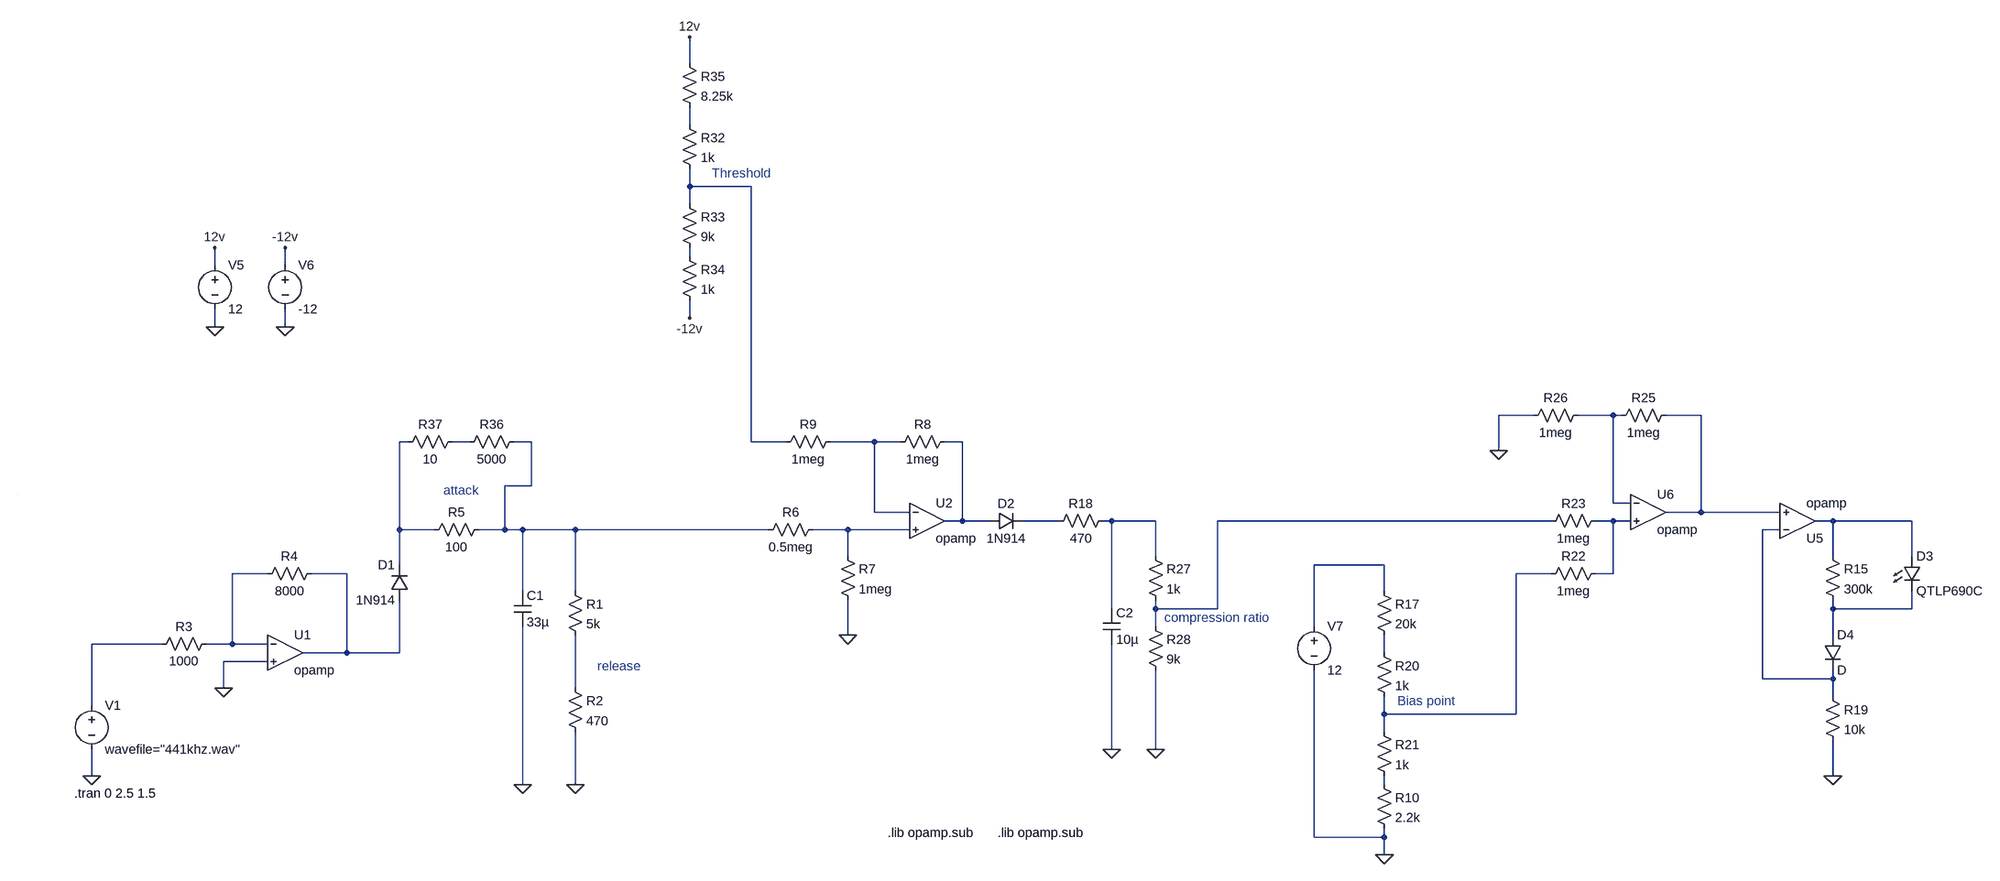
[diagram p0: schematic test_wavsource_2.asc]
test_wavsource_2.asc, the LTspice schematic file:
Version 4
SHEET 1 4852 868
WIRE 1808 -832 1808 -880
WIRE 1808 -720 1808 -752
WIRE 1808 -608 1808 -640
WIRE 1920 -608 1808 -608
WIRE 1808 -576 1808 -608
WIRE 1808 -480 1808 -496
WIRE 944 -464 944 -496
WIRE 1072 -464 1072 -496
WIRE 1808 -368 1808 -400
WIRE 944 -352 944 -384
WIRE 1072 -352 1072 -384
WIRE 3344 -144 3280 -144
WIRE 3488 -144 3424 -144
WIRE 3504 -144 3488 -144
WIRE 3648 -144 3584 -144
WIRE 1296 -96 1280 -96
WIRE 1408 -96 1376 -96
WIRE 1520 -96 1488 -96
WIRE 1920 -96 1920 -608
WIRE 1984 -96 1920 -96
WIRE 2144 -96 2064 -96
WIRE 2192 -96 2144 -96
WIRE 2304 -96 2272 -96
WIRE 3280 -80 3280 -144
WIRE 1520 -16 1520 -96
WIRE 1520 -16 1472 -16
WIRE 3488 16 3488 -144
WIRE 3520 16 3488 16
WIRE 2144 32 2144 -96
WIRE 2208 32 2144 32
WIRE 3648 32 3648 -144
WIRE 3648 32 3584 32
WIRE 3872 32 3648 32
WIRE 2304 48 2304 -96
WIRE 2304 48 2272 48
WIRE 2352 48 2304 48
WIRE 2480 48 2416 48
WIRE 2576 48 2560 48
WIRE 2656 48 2576 48
WIRE 3376 48 2768 48
WIRE 3488 48 3456 48
WIRE 3520 48 3488 48
WIRE 3968 48 3936 48
WIRE 4112 48 3968 48
WIRE 1280 64 1280 -96
WIRE 1344 64 1280 64
WIRE 1472 64 1472 -16
WIRE 1472 64 1424 64
WIRE 1504 64 1472 64
WIRE 1600 64 1504 64
WIRE 1952 64 1600 64
WIRE 2096 64 2032 64
WIRE 2208 64 2096 64
WIRE 3872 64 3840 64
WIRE 2096 112 2096 64
WIRE 2656 112 2656 48
WIRE 3968 112 3968 48
WIRE 4112 112 4112 48
WIRE 1280 128 1280 64
WIRE 3072 128 2944 128
WIRE 1040 144 976 144
WIRE 1184 144 1120 144
WIRE 3376 144 3312 144
WIRE 3488 144 3488 48
WIRE 3488 144 3456 144
WIRE 1504 176 1504 64
WIRE 1600 176 1600 64
WIRE 3072 176 3072 128
WIRE 2576 208 2576 48
WIRE 2656 208 2656 192
WIRE 2768 208 2768 48
WIRE 2768 208 2656 208
WIRE 3968 208 3968 192
WIRE 4112 208 4112 176
WIRE 4112 208 3968 208
WIRE 2656 240 2656 208
WIRE 2944 240 2944 128
WIRE 2096 256 2096 192
WIRE 3968 256 3968 208
WIRE 848 272 720 272
WIRE 976 272 976 144
WIRE 976 272 928 272
WIRE 1040 272 976 272
WIRE 1184 288 1184 144
WIRE 1184 288 1104 288
WIRE 1280 288 1280 192
WIRE 1280 288 1184 288
WIRE 3072 288 3072 256
WIRE 1040 304 960 304
WIRE 3840 336 3840 64
WIRE 3968 336 3968 320
WIRE 3968 336 3840 336
WIRE 960 352 960 304
WIRE 1600 352 1600 256
WIRE 3968 368 3968 336
WIRE 720 384 720 272
WIRE 3072 400 3072 368
WIRE 3312 400 3312 144
WIRE 3312 400 3072 400
WIRE 3072 432 3072 400
WIRE 2576 464 2576 272
WIRE 2656 464 2656 320
WIRE 720 512 720 464
WIRE 3968 512 3968 448
WIRE 1504 528 1504 240
WIRE 1600 528 1600 432
WIRE 3072 528 3072 512
WIRE 2944 624 2944 320
WIRE 3072 624 3072 608
WIRE 3072 624 2944 624
WIRE 3072 656 3072 624
WIRE 0 0 0 0
FLAG 720 512 0
FLAG 960 352 0
FLAG 1600 528 0
FLAG 1504 528 0
FLAG 3968 512 0
FLAG 3072 656 0
FLAG 3280 -80 0
FLAG 2656 464 0
FLAG 2576 464 0
FLAG 944 -352 0
FLAG 1072 -352 0
FLAG 1072 -496 -12v
FLAG 944 -496 12v
FLAG 1808 -880 12v
FLAG 1808 -368 -12v
FLAG 2096 256 0
SYMBOL voltage 720 368 R0
SYMATTR InstName V1
SYMATTR Value wavefile="441khz.wav"
SYMBOL diode 1296 192 R180
WINDOW 0 24 64 Left 2
WINDOW 3 24 0 Left 2
SYMATTR InstName D1
SYMATTR Value 1N914
SYMBOL cap 1488 176 R0
SYMATTR InstName C1
SYMATTR Value 33µ
SYMBOL res 1584 160 R0
SYMATTR InstName R1
SYMATTR Value 5k
SYMBOL Opamps\\opamp 1072 224 R0
SYMATTR InstName U1
SYMBOL res 1136 128 R90
WINDOW 0 0 56 VBottom 2
WINDOW 3 32 56 VTop 2
SYMATTR InstName R4
SYMATTR Value 8000
SYMBOL res 944 256 R90
WINDOW 0 0 56 VBottom 2
WINDOW 3 32 56 VTop 2
SYMATTR InstName R3
SYMATTR Value 1000
SYMBOL res 1584 336 R0
SYMATTR InstName R2
SYMATTR Value 470
SYMBOL res 1328 80 R270
WINDOW 0 32 56 VTop 2
WINDOW 3 0 56 VBottom 2
SYMATTR InstName R5
SYMATTR Value 100
SYMBOL Opamps\\opamp 2240 -16 R0
SYMATTR InstName U2
SYMBOL res 2176 -80 R270
WINDOW 0 32 56 VTop 2
WINDOW 3 0 56 VBottom 2
SYMATTR InstName R8
SYMATTR Value 1meg
SYMBOL res 1968 -80 R270
WINDOW 0 32 56 VTop 2
WINDOW 3 0 56 VBottom 2
SYMATTR InstName R9
SYMATTR Value 1meg
SYMBOL diode 2352 64 R270
WINDOW 0 32 32 VTop 2
WINDOW 3 0 32 VBottom 2
SYMATTR InstName D2
SYMATTR Value 1N914
SYMBOL Opamps\\opamp 3904 112 M180
SYMATTR InstName U5
SYMBOL LED 4096 112 R0
SYMATTR InstName D3
SYMATTR Value QTLP690C
SYMATTR Description Diode
SYMATTR Type diode
SYMBOL diode 3952 256 R0
SYMATTR InstName D4
SYMBOL res 3952 96 R0
SYMATTR InstName R15
SYMATTR Value 300k
SYMBOL res 3952 352 R0
SYMATTR InstName R19
SYMATTR Value 10k
SYMBOL Opamps\\opamp 3552 -32 R0
SYMATTR InstName U6
SYMBOL res 3056 272 R0
SYMATTR InstName R20
SYMATTR Value 1k
SYMBOL res 3056 416 R0
SYMATTR InstName R21
SYMATTR Value 1k
SYMBOL res 3472 128 R90
WINDOW 0 0 56 VBottom 2
WINDOW 3 32 56 VTop 2
SYMATTR InstName R22
SYMATTR Value 1meg
SYMBOL res 3472 32 R90
WINDOW 0 0 56 VBottom 2
WINDOW 3 32 56 VTop 2
SYMATTR InstName R23
SYMATTR Value 1meg
SYMBOL voltage 2944 224 R0
WINDOW 123 0 0 Left 2
WINDOW 39 0 0 Left 2
SYMATTR InstName V7
SYMATTR Value 12
SYMBOL res 3600 -160 R90
WINDOW 0 0 56 VBottom 2
WINDOW 3 32 56 VTop 2
SYMATTR InstName R25
SYMATTR Value 1meg
SYMBOL res 3440 -160 R90
WINDOW 0 0 56 VBottom 2
WINDOW 3 32 56 VTop 2
SYMATTR InstName R26
SYMATTR Value 1meg
SYMBOL res 2640 96 R0
SYMATTR InstName R27
SYMATTR Value 1k
SYMBOL res 2640 224 R0
SYMATTR InstName R28
SYMATTR Value 9k
SYMBOL res 3056 512 R0
SYMATTR InstName R10
SYMATTR Value 2.2k
SYMBOL res 3056 160 R0
SYMATTR InstName R17
SYMATTR Value 20k
SYMBOL res 2464 64 R270
WINDOW 0 32 56 VTop 2
WINDOW 3 0 56 VBottom 2
SYMATTR InstName R18
SYMATTR Value 470
SYMBOL cap 2560 208 R0
SYMATTR InstName C2
SYMATTR Value 10µ
SYMBOL voltage 1072 -480 R0
WINDOW 123 0 0 Left 2
WINDOW 39 0 0 Left 2
SYMATTR InstName V6
SYMATTR Value -12
SYMBOL res 1792 -736 R0
SYMATTR InstName R32
SYMATTR Value 1k
SYMBOL res 1792 -592 R0
SYMATTR InstName R33
SYMATTR Value 9k
SYMBOL res 1792 -496 R0
SYMATTR InstName R34
SYMATTR Value 1k
SYMBOL res 1792 -848 R0
SYMATTR InstName R35
SYMATTR Value 8.25k
SYMBOL voltage 944 -480 R0
WINDOW 123 0 0 Left 2
WINDOW 39 0 0 Left 2
SYMATTR InstName V5
SYMATTR Value 12
SYMBOL res 1504 -112 R90
WINDOW 0 0 56 VBottom 2
WINDOW 3 32 56 VTop 2
SYMATTR InstName R36
SYMATTR Value 5000
SYMBOL res 1392 -112 R90
WINDOW 0 0 56 VBottom 2
WINDOW 3 32 56 VTop 2
SYMATTR InstName R37
SYMATTR Value 10
SYMBOL res 1936 80 R270
WINDOW 0 32 56 VTop 2
WINDOW 3 0 56 VBottom 2
SYMATTR InstName R6
SYMATTR Value 0.5meg
SYMBOL res 2080 96 R0
SYMATTR InstName R7
SYMATTR Value 1meg
TEXT 688 544 Left 2 !.tran 0 2.5 1.5
TEXT 2168 616 Left 2 !.lib opamp.sub
TEXT 2368 616 Left 2 !.lib opamp.sub
TEXT 1848 -632 Left 2 ;Threshold
TEXT 2672 224 Left 2 ;compression ratio
TEXT 3096 376 Left 2 ;Bias point
TEXT 1640 312 Left 2 ;release
TEXT 1360 -8 Left 2 ;attack

The netlist it stands for:
* test_wavsource_2.asc
V1 N023 0 wavefile="441khz.wav"
D1 N020 N006 1N914
C1 N008 0 33µ
R1 N008 N025 5k
XU1 N019 0 N020 opamp Aol=100K GBW=10Meg  ; pins invin noninvin out
R4 N020 N019 8000
R3 N019 N023 1000
R2 N025 0 470
R5 N006 N008 100
XU2 N009 N016 N010 opamp Aol=100K GBW=10Meg  ; pins invin noninvin out
R8 N009 N010 1meg
R9 N002 N009 1meg
D2 N010 N011 1N914
XU5 N017 N005 N015 opamp Aol=100K GBW=10Meg  ; pins invin noninvin out
D3 N015 N022 QTLP690C
D4 N022 N017 D
R15 N015 N022 300k
R19 N017 0 10k
XU6 N004 N014 N005 opamp Aol=100K GBW=10Meg  ; pins invin noninvin out
R20 N024 N021 1k
R21 N021 N026 1k
R22 N014 N021 1meg
R23 N014 N013 1meg
V7 N018 0 12
R25 N005 N004 1meg
R26 N004 0 1meg
R27 N012 N013 1k
R28 N013 0 9k
R10 N026 0 2.2k
R17 N018 N024 20k
R18 N011 N012 470
C2 N012 0 10µ
V6 -12v 0 -12
R32 N001 N002 1k
R33 N002 N003 9k
R34 N003 -12v 1k
R35 12v N001 8.25k
V5 12v 0 12
R36 N008 N007 5000
R37 N007 N006 10
R6 N008 N016 0.5meg
R7 N016 0 1meg
.model D D
.lib standard.dio
.tran 0 2.5 1.5
.lib opamp.sub
.lib opamp.sub
* Threshold
* compression ratio
* Bias point
* release
* attack
.backanno
.end